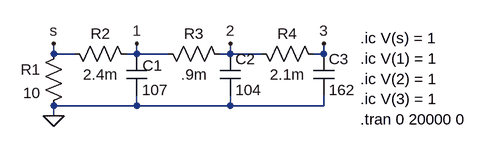
[diagram p0: schematic discharge.asc]
discharge.asc, the LTspice schematic file:
Version 4
SHEET 1 880 680
WIRE 64 112 64 96
WIRE 96 112 64 112
WIRE 192 112 192 96
WIRE 192 112 176 112
WIRE 240 112 192 112
WIRE 336 112 336 96
WIRE 336 112 320 112
WIRE 384 112 336 112
WIRE 480 112 480 96
WIRE 480 112 464 112
WIRE 192 192 192 176
WIRE 192 192 64 192
WIRE 336 192 336 176
WIRE 336 192 192 192
WIRE 480 192 480 176
WIRE 480 192 336 192
WIRE 64 208 64 192
FLAG 64 208 0
FLAG 64 96 s
FLAG 192 96 1
FLAG 336 96 2
FLAG 480 96 3
SYMBOL res 80 96 M0
SYMATTR InstName R1
SYMATTR Value 10
SYMBOL res 80 96 M90
WINDOW 0 0 56 VBottom 2
WINDOW 3 32 56 VTop 2
SYMATTR InstName R2
SYMATTR Value 2.4m
SYMBOL cap 176 112 R0
WINDOW 0 25 18 Left 2
SYMATTR InstName C1
SYMATTR Value 107
SYMBOL res 224 96 M90
WINDOW 0 0 56 VBottom 2
WINDOW 3 32 56 VTop 2
SYMATTR InstName R3
SYMATTR Value .9m
SYMBOL cap 320 112 R0
SYMATTR InstName C2
SYMATTR Value 104
SYMBOL res 368 96 M90
WINDOW 0 0 56 VBottom 2
WINDOW 3 32 56 VTop 2
SYMATTR InstName R4
SYMATTR Value 2.1m
SYMBOL cap 464 112 R0
SYMATTR InstName C3
SYMATTR Value 162
TEXT 536 88 Left 2 !.ic V(s) = 1\n.ic V(1) = 1\n.ic V(2) = 1\n.ic V(3) = 1\n.tran 0 20000 0

The netlist it stands for:
* discharge.asc
R1 s 0 10
R2 s 1 2.4m
C1 1 0 107
R3 1 2 .9m
C2 2 0 104
R4 2 3 2.1m
C3 3 0 162
.ic V(s) = 1
.ic V(1) = 1
.ic V(2) = 1
.ic V(3) = 1
.tran 0 20000 0
.backanno
.end